# Altium project USB2UART.PrjPCB
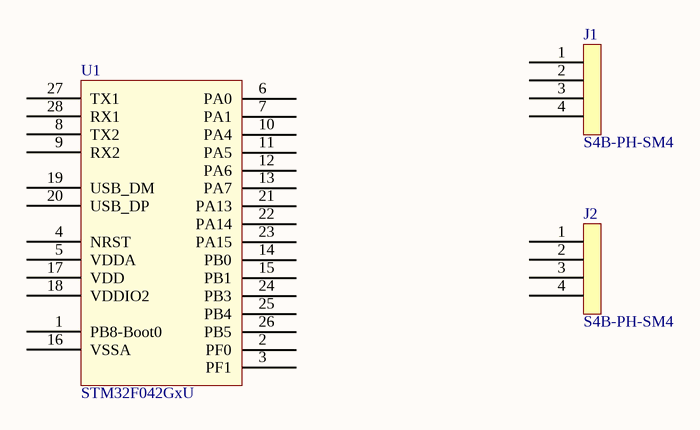
[diagram p0: USB2UART.SchDoc]
1 sheet, 3 parts. Net scope: global (net labels, ports and power ports of the same name join across sheets).

## Sheet USB2UART.SchDoc
size A4

### Parts
J1  S4B-PH-SM4  [S4B-PH-SM4]
J2  S4B-PH-SM4  [S4B-PH-SM4]
U1  STM32F042GxU  [UFQFPN28-4x4mm]

### Nets

Not connected (* = marked no-connect by the designer): J1 1 2 3 4; J2 1 2 3 4; U1 1(PB8-Boot0) 2(PF0) 3(PF1) 4(NRST) 5(VDDA) 6(PA0) 7(PA1) 8(TX2) 9(RX2) 10(PA4) 11(PA5) 12(PA6) 13(PA7) 14(PB0) 15(PB1) 16(VSSA) 17(VDD) 18(VDDIO2) 19(USB_DM) 20(USB_DP) 21(PA13) 22(PA14) 23(PA15) 24(PB3) 25(PB4) 26(PB5) 27(TX1) 28(RX1)

### Library data of the parts
U1 = STM32F042GxU: Imported; Vendor: STMicroelectronics; C: Copyright (C) 2016 Accelerated Designs. All rights reserved; Copyright: Copyright (C) 2016 Accelerated Designs. All rights reserved; Manufacturer_Part_Number: stm32f042gxu; Value: Value; Type: Type; RefDes: RefDes